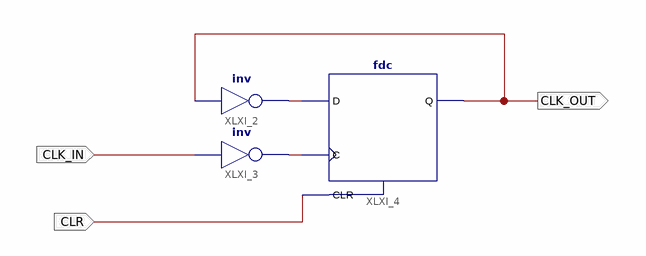
[diagram p0: schematic sheet 1]
// Xilinx ISE schematic diviser_2.sch (spartan6) as structural Verilog: 3 symbols, 3 ports
module diviser_2 (
  input  CLK_IN,
  input  CLR,
  output CLK_OUT
);

  wire XLXN_5, XLXN_6;

  not XLXI_2 (XLXN_5, CLK_OUT);
  not XLXI_3 (XLXN_6, CLK_IN);
  fdc XLXI_4 (.C(XLXN_6), .CLR(CLR), .D(XLXN_5), .Q(CLK_OUT));
endmodule
